# Altium schematic sheet I2C-EEPROM.SchDoc: =ProjectTitle
size 297 x 209 mm; Address1: Address1; Address2: Address2; Address3: Address3; Address4: Address4; SheetNumber: 10; SheetTotal: 17; Scale: 1:1; DocumentType: Схема электрическая принципиальная
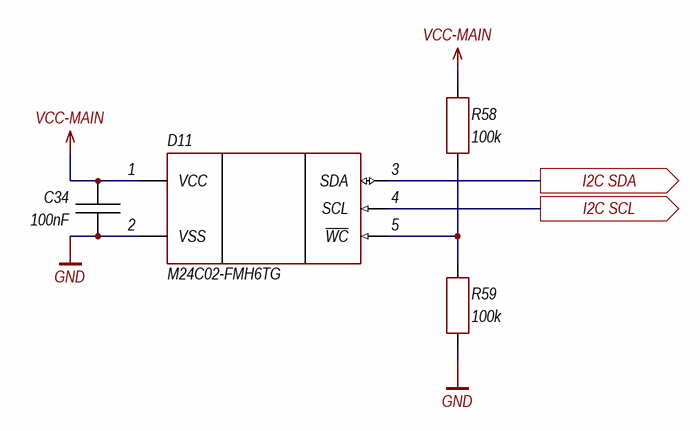
[diagram p0: I2C-EEPROM.SchDoc]

## Parts
C34  100nF  [CH0402C]
D11  M24C02-FMH6TG  [5-UFDFPN]
R58  100k  [CH0402R]
R59  100k  [CH0402R]

## Ports
I2C SCL (out), I2C SDA (out)

## Nets
GND: C34.1 D11.2(VSS) R59.1
VCC-MAIN: C34.2 D11.1(VCC) R58.2
I2C SCL: D11.4(SCL) ; port I2C SCL
I2C SDA: D11.3(SDA) ; port I2C SDA
NetD11_5: D11.5(~{WC}) R58.1 R59.2

## Notes on the sheet
- Изм.
- Лист
- № докум.
- Подп.
- Дата
- Копировал
- Формат А4

## Library data of the parts
C34 = Capacitor: Manufacturer: *; Model: *; HelpURL: *; ComponentKind: *; Value: 100nF
D11 = M24C0x-FMH6TG: EEPROM, I2C; Manufacturer: STMicroelectronics; Model: M24C02-FMH6TG; HelpURL: https://lcsc.com/product-detail/EEPROM_STMicroelectronics-M24C02-FMH6TG_C222197.html; ComponentKind: 1.8-5.5V, 256x8bit, I2C
R58 R59 = Resistor: Manufacturer: *; Model: *; HelpURL: *; ComponentKind: *; Value: 100k